# Altium schematic sheet POWER.SchDoc (part 2 of 3)
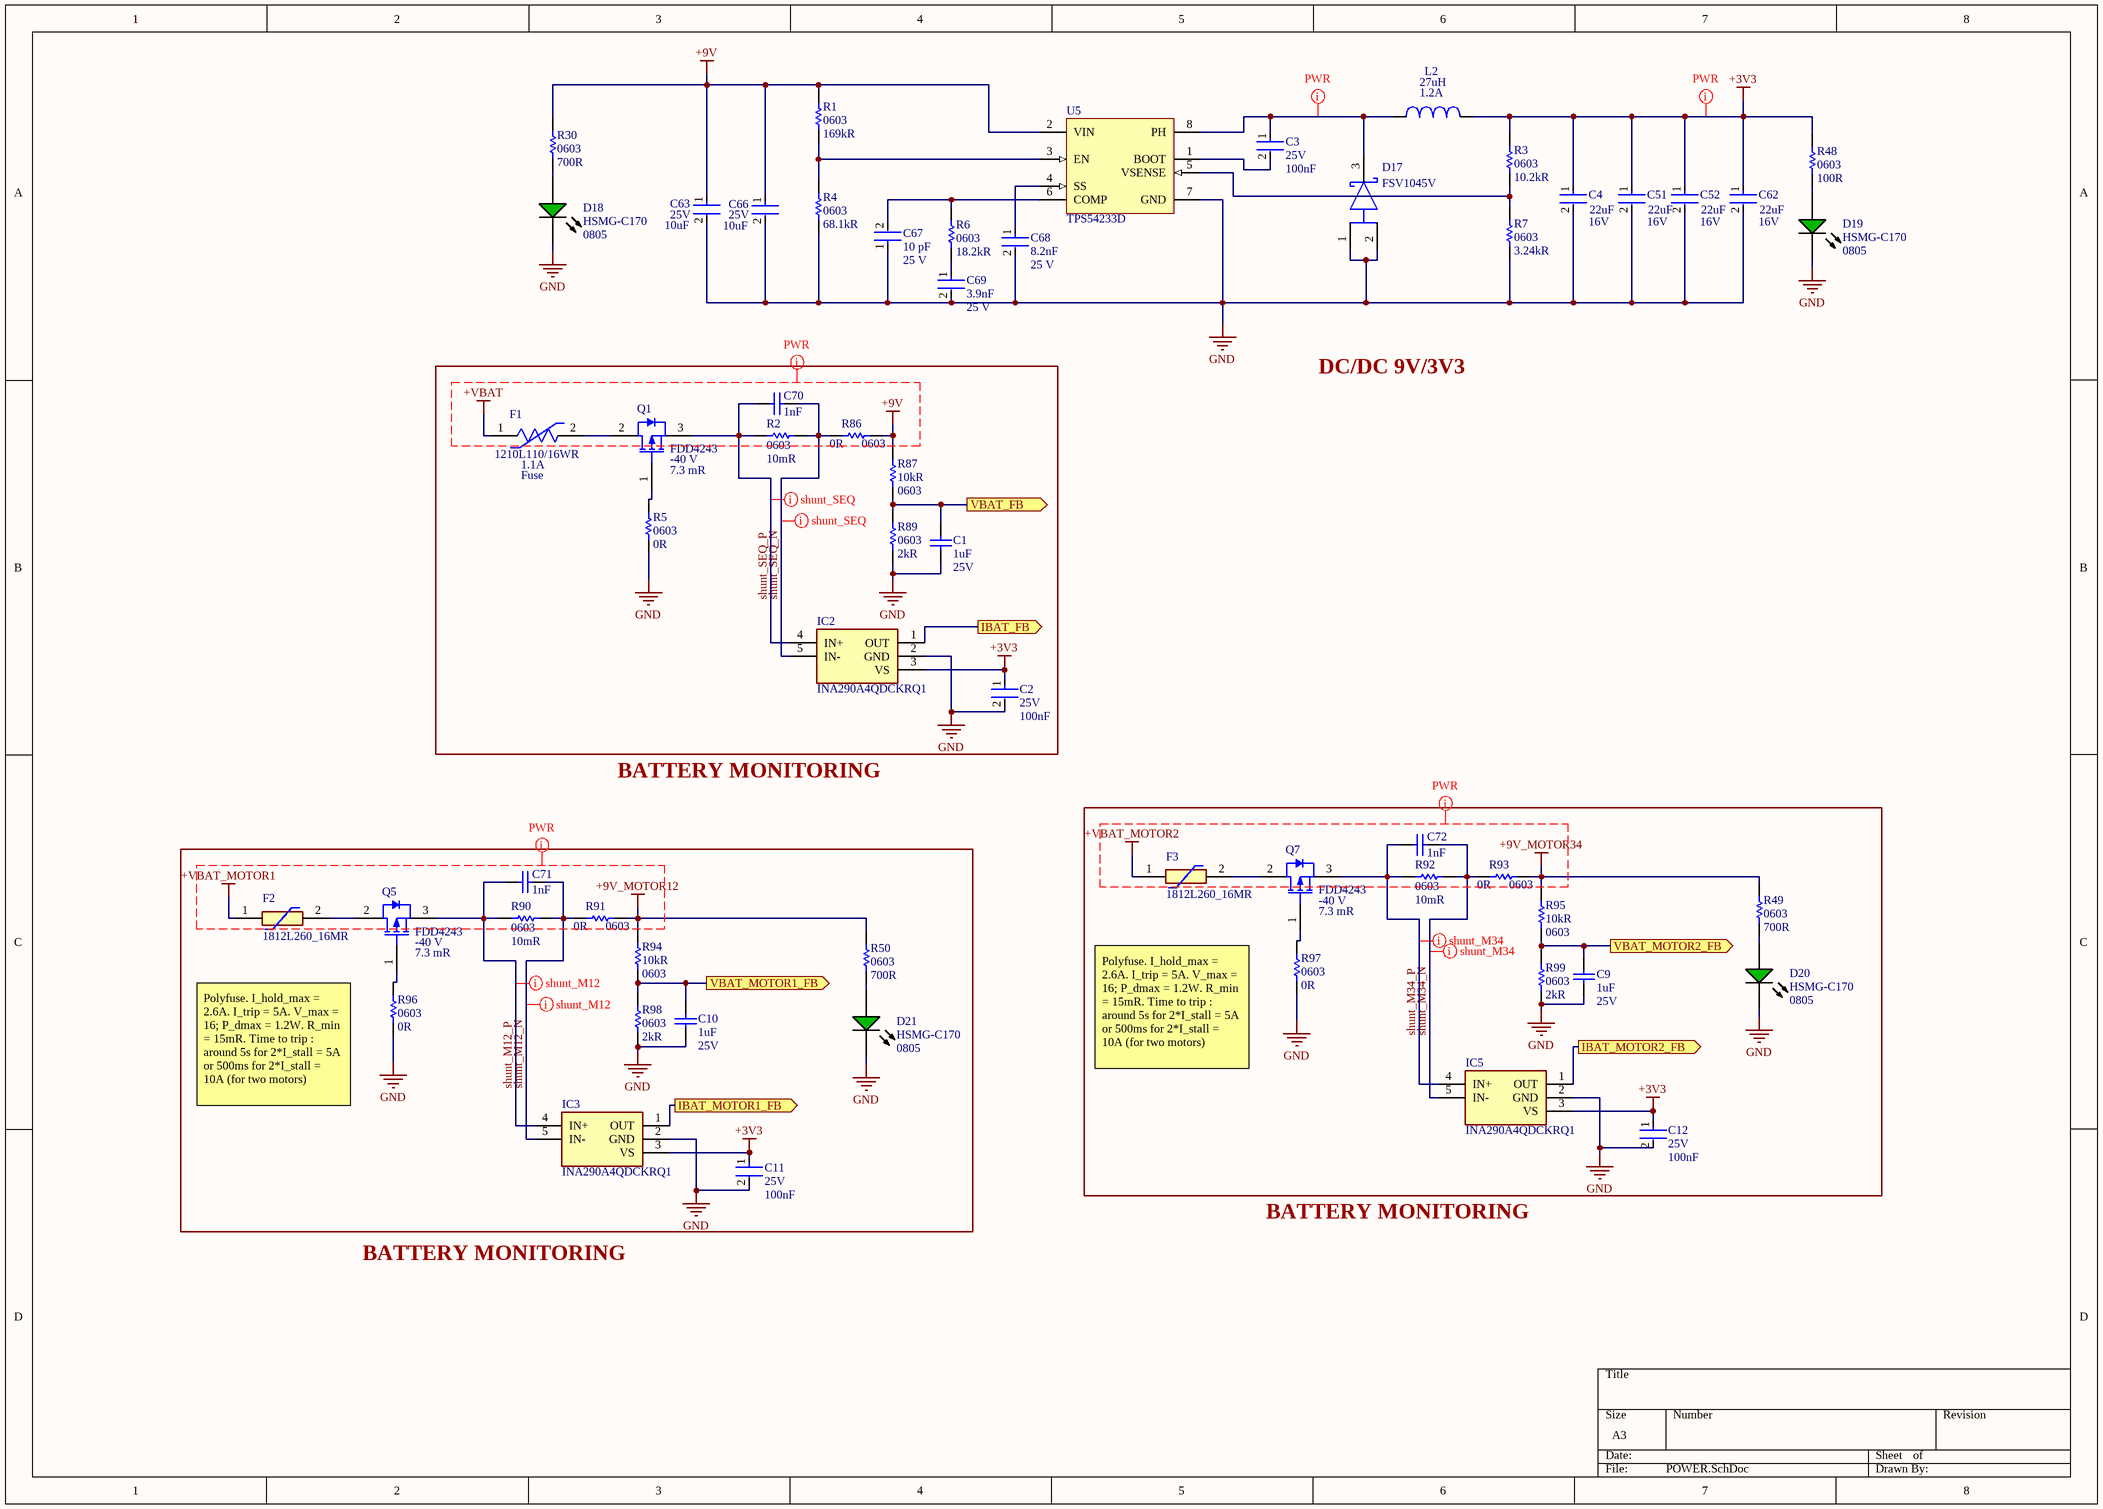
[diagram p1: POWER.SchDoc]
## Library data of the parts
C1 C9 C10 = CMP-2006-02216-2: Manufacturer: Kemet; Manufacturer Part Number: C0603C105K3PACTU; Dielectric Material: Ceramic; Tolerance: 10%; Dielectric: X5R; Part Number: C0603C105K3PAC7867; Supplier 1: Mouser; Supplier Part Number 1: 80-C0603C105K3P; RoHS: Yes; Category: Ceramic Capacitors; Stock 1: 10085; Pricing 1: 1=0,30000, 10=0,15600, 50=0,15600, 100=0,09300, 500=0,08200, 1000=0,07300, 4000=0,05700, 10000=0,05700 (USD); Mount: Surface Mount,PCB; Case/Package: 0603; Number of Pins: 2; Case Code (Imperial): 0603; Case Code (Metric): 1608; Contact Plating: Tin,Matte; Min Operating Temperature: -55°C; Max Operating Temperature: 85°C; Packaging: Tape and Reel; Termination: SMD/SMT; Voltage Rating: 25V; Package Quantity: 4000; Voltage: 25V; Series: C0603C; Construction: Flat; Length: 1.6mm; Width: 0.031inch; Height: 0.8mm; Depth: 0.8mm; Thickness: 0.034inch; Radiation Hardening: No; REACH SVHC: No SVHC; RoHS Compliant: Yes; Lead Free: Lead Free; ComponentLink1URL: https://datasheet.ciiva.com/5998/40889-5998745.pdf?src-supplier=Farnell; ComponentLink1Description: https://datasheet.ciiva.com/5998/40889-5998745.pdf?src-supplier=Farnell; ComponentLink2URL: https://datasheet.ciiva.com/28610/1918694-28610792.pdf?src-supplier=Element14; ComponentLink2Description: https://datasheet.ciiva.com/28610/1918694-28610792.pdf?src-supplier=Element14
C2 C3 C11 C12 = CMP-08246-002186-1: Cap Ceramic 100nF 25V X7R 10% Pad SMD 0603 +125°C Automotive T/R; Manufacturer: TDK; Composition: Ceramic; Dielectric: X7R; Ratings: AEC-Q200; Length: 1.6mm; REACH SVHC: No SVHC; Width: 0.031inch; Packaging: Tape and Reel; Case/Package: 0603; Height: 0.8mm; Termination: SMD/SMT; Max Operating Temperature: 125°C; Thickness: 0.035inch; Case Code (Metric): 1608; Lead Free: Lead Free; Mount: Surface Mount; Voltage Rating: 25V; Tolerance: 10%; Weight: 7.1E-05oz; Min Operating Temperature: -55°C; Package Quantity: 1; Depth: 0.8mm; Case Code (Imperial): 0603; Supplier 1: Mouser; Supplier Part Number 1: 810-CGA3E2X7R1E104K; Manufacturer Part Number: CGA3E2X7R1E104K080AA; RoHS: Yes; Category: Ceramic Capacitors; Stock 1: 488891; Pricing 1: 1=0,12000, 10=0,05600, 50=0,05600, 100=0,02500, 1000=0,01400, 10000=0,01000 (USD); Series: CGA; Resistor Type: Ceramic; RoHS Compliant: Yes; ComponentLink1URL: https://datasheet.ciiva.com/24220/cga3e2x7r1e104k080aa-265934-24220022.pdf?src-supplier=Mouser; ComponentLink1Description: https://datasheet.ciiva.com/24220/cga3e2x7r1e104k080aa-265934-24220022.pdf?src-supplier=Mouser; ComponentLink2URL: https://datasheet.ciiva.com/22725/1735392-22725638.pdf?src-supplier=Element14; ComponentLink2Description: https://datasheet.ciiva.com/22725/1735392-22725638.pdf?src-supplier=Element14; ComponentLink3URL: https://datasheet.ciiva.com/22725/1735392-22725639.pdf?src-supplier=Element14; ComponentLink3Description: https://datasheet.ciiva.com/22725/1735392-22725639.pdf?src-supplier=Element14; ComponentLink4URL: https://datasheet.ciiva.com/16427/mlccspec-automotive-general-midvoltage-en-16427320.pdf?src-supplier=Future+Electronics; ComponentLink4Description: https://datasheet.ciiva.com/16427/mlccspec-automotive-general-midvoltage-en-16427320.pdf?src-supplier=Future+Electronics; ComponentLink5URL: https://datasheet.ciiva.com/23803/1735392-23803082.pdf?src-supplier=Newark; ComponentLink5Description: https://datasheet.ciiva.com/23803/1735392-23803082.pdf?src-supplier=Newark
C4 C51 C52 C62 = CMP-2000-06037-2: CAP CER 22UF 16V X5R 0805; Manufacturer: TDK; Tolerance: 10%; Material: Ceramic; Temperature Coefficient: 15%; Octopart: https://octopart.com/c2012x5r1c226k125ac-tdk-25947713; ComponentLink2Description: Datasheet; Category: Cap; Temperature: -55°C to +85°C; Device Class L3: Ceramic Capacitors; ComponentLink2URL: https://product.tdk.com/info/en/catalog/datasheets/mlcc_commercial_general_en.pdf; Lead Free: Yes; Temperature Range High: +85°C; Temperature Range Low: -55°C; Package: C2012-125; RoHS: TRUE; Temperature Characteristic: X5R; Voltage Rating: 16V; Height: 1.45mm; Digikey Description: CAP CER 22UF 16V X5R 0805; Capacitance: 22uF; Manufacturer Part Number: C2012X5R1C226K125AC; Device Class L1: Passive Components; Device Class L2: Capacitors; Footprint Url: https://product.tdk.com/info/en/catalog/spec/mlccspec_commercial_general_midvoltage_en.pdf; Ipc Land Pattern Name: CAPC200125X125; Automotive: No
C63 C66 = CMP-08246-002675-1: Multilayer Ceramic Capacitors 10μF ±10% 25V X5R SMD 0805; Manufacturer: TDK; Packaging: Tape and Reel; Dielectric: X5R; Case/Package: 0805; Lead Free: Lead Free; Dielectric Material: Ceramic; Series: C; Termination: SMD/SMT; Voltage: 25V; Depth: 1.25mm; Max Operating Temperature: 85°C; Resistor Type: Ceramic; Weight: 0.000194oz; Case Code (Metric): 2012; Height: 1.25mm; Mount: Surface Mount; Voltage Rating: 25V; Length: 2mm; REACH SVHC: No SVHC; Min Operating Temperature: -55°C; Case Code (Imperial): 0805; Thickness: 0.057inch; Width: 0.049inch; Tolerance: 10%; Package Quantity: 1; Supplier 1: Mouser; Supplier Part Number 1: 810-C2012X5R1E106K; Manufacturer Part Number: C2012X5R1E106K125AB; RoHS: Yes; Category: Ceramic Capacitors; Stock 1: 75897; Pricing 1: 1=0,34000, 10=0,24100, 50=0,24100, 100=0,14400, 1000=0,09100, 10000=0,08800 (USD); ComponentLink1URL: https://datasheet.ciiva.com/22725/1913358-22725561.pdf?src-supplier=Element14; ComponentLink1Description: https://datasheet.ciiva.com/22725/1913358-22725561.pdf?src-supplier=Element14; ComponentLink2URL: https://datasheet.ciiva.com/16394/general-b11-16394044.pdf?src-supplier=Future+Electronics; ComponentLink2Description: https://datasheet.ciiva.com/16394/general-b11-16394044.pdf?src-supplier=Future+Electronics; ComponentLink3URL: https://datasheet.ciiva.com/24216/mlcc-commercial-general-en-24216237.pdf?src-supplier=Mouser; ComponentLink3Description: https://datasheet.ciiva.com/24216/mlcc-commercial-general-en-24216237.pdf?src-supplier=Mouser
C67 = CMP-03020-028619-1: CAP CER 10PF 25V NP0 0603; Manufacturer: KEMET; Automotive Grade: Grade 1; Tolerance: 0.05; Temperature Characteristic: C0G; Material: Ceramic; Temperature Coefficient: 30ppm/°C; Dissipation Factor: 0.1%; Value: 10 pF; Manufacturer Part Number: C0603C100J3GACTU; Height: 0.87mm; Temperature Range High: +125°C; Automotive: Yes; Category: Cap; Temperature Range Low: -55°C; Device Class L2: Capacitors; ComponentLink2Description: Datasheet; Digikey Description: CAP CER 10PF 25V NP0 0603; Lead Free: Yes; Temperature: -55°C to +125°C; Package: C0603C-CF; Mouser Description: Capacitor, Ceramic, 10Pf, 25Vdc, 5-% Tol, 5+% Tol, C0g-Tc Code, -30, 30Ppm-Tc Rohs Compliant: Yes; Device Class L3: Ceramic Capacitors; Octopart: https://octopart.com/c0603c100j3gactu-kemet-16430573; ComponentLink2URL: https://api.kemet.com/component-edge/download/datasheet/C0603C100J5GACAUTO.pdf; Device Class L1: Passive Components; RoHS: TRUE; Supplier 1: Mouser; Supplier Part Number 1: 80-C0603C100J3G; Stock 1: 3745; Pricing 1: 1=0,26000, 10=0,18000, 50=0,18000, 100=0,10300, 1000=0,06400, 10000=0,05500 (USD); Mount: Surface Mount; Case/Package: 0603; Case Code (Metric): 1608; Case Code (Imperial): 0603; Dielectric Material: Ceramic; Min Operating Temperature: -55°C; Max Operating Temperature: 125°C; Package Quantity: 4000; Packaging: Tape and Reel; Voltage Rating (DC): 25V; Dielectric: C0G; Termination: SMD/SMT; Series: C; Construction: Flat; Length: 1.6mm; Width: 0.031inch; Thickness: 0.034inch; Depth: 0.8mm; Lead Pitch: 0.7mm; Radiation Hardening: No; RoHS Compliant: Yes; ComponentLink1URL: https://datasheet.ciiva.com/5450/kem-c1003-c0g-smd-356956-5450264.pdf?src-supplier=Mouser; ComponentLink1Description: https://datasheet.ciiva.com/5450/kem-c1003-c0g-smd-356956-5450264.pdf?src-supplier=Mouser
C68 = CMP-2006-03852-2: CAP CER 8200PF 25V X7R 0603; Manufacturer: KEMET; Automotive Grade: Grade 1; Capacitance: 8,200 pF; Tolerance: 0.1; Material: Ceramic; Temperature Coefficient: 30ppm/°C; Dissipation Factor: 10%; Temperature Characteristic: X7R; Height: 0.87mm; Device Class L2: Capacitors; Device Class L1: Passive Components; Temperature Range High: +125°C; ComponentLink2URL: https://api.kemet.com/component-edge/download/datasheet/C0603C100J5GACAUTO.pdf; ComponentLink2Description: Datasheet; Mouser Description: Capacitor, Ceramic, 8.2Nf, 25Vdc, 10-% Tol, 10+% Tol, X7r-Tc Code, -15, 15%-Tc Rohs Compliant: Yes; Temperature: -55°C to +125°C; Lead Free: Yes; Device Class L3: Ceramic Capacitors; Temperature Range Low: -55°C; Package: C0603C-CF; Octopart: https://octopart.com/c0603c822k3ractu-kemet-9144236; Category: Cap; RoHS: TRUE; Digikey Description: CAP CER 8200PF 25V X7R 0603; Manufacturer Part Number: C0603C822K3RACTU; Automotive: Yes; Supplier 1: Mouser; Supplier Part Number 1: 80-C0603C822K3R; Stock 1: 7611; Pricing 1: 1=0,26000, 10=0,18000, 50=0,18000, 100=0,10200, 1000=0,06300, 10000=0,05500 (USD); Mount: Surface Mount; Case/Package: 0603; Case Code (Metric): 1608; Case Code (Imperial): 0603; Dielectric Material: Ceramic; Min Operating Temperature: -55°C; Max Operating Temperature: 125°C; Packaging: Tape and Reel; Termination: SMD/SMT; Voltage Rating (DC): 25V; Package Quantity: 4000; Series: C; Dielectric: X7R; Length: 1.6mm; Width: 0.031inch; Thickness: 0.034inch; Depth: 0.8mm; Lead Pitch: 0.7mm; RoHS Compliant: Yes; ComponentLink1URL: https://datasheet.ciiva.com/5437/kem-c1002-x7r-smd-357932-5437145.pdf?src-supplier=Mouser; ComponentLink1Description: https://datasheet.ciiva.com/5437/kem-c1002-x7r-smd-357932-5437145.pdf?src-supplier=Mouser
C69 = CMP-1035-02159-3: CAP CER 3900PF 25V X7R 0603; Manufacturer: KEMET; Automotive Grade: Grade 1; Value: 3,900 pF; Material: Ceramic; Tolerance: 0.1; Temperature Coefficient: 30ppm/°C; Temperature Range Low: -55°C; Automotive: Yes; Digikey Description: CAP CER 3900PF 25V X7R 0603; Device Class L1: Passive Components; Device Class L2: Capacitors; Octopart: https://octopart.com/c0603c392k3ractu-kemet-12624904; Mouser Description: Cap Ceramic 0.0039uF 25V X7R 10% SMD 0603 125°C Paper T/R; ComponentLink2URL: https://api.kemet.com/component-edge/download/datasheet/C0603C100J5GACAUTO.pdf; Lead Free: Yes; Manufacturer Part Number: C0603C392K3RACTU; RoHS: TRUE; Category: Cap; ComponentLink2Description: Datasheet; Height: 0.87mm; Device Class L3: Ceramic Capacitors; Package: C0603C-CF; Temperature Characteristic: X7R; Temperature: -55°C to +125°C; Temperature Range High: +125°C; Supplier 1: Mouser; Supplier Part Number 1: 80-C0603C392K3R; Stock 1: 897; Pricing 1: 1=0,26000, 10=0,18000, 50=0,18000, 100=0,10200, 1000=0,06300, 10000=0,05500 (USD); Mount: Surface Mount; Case/Package: 0603; Case Code (Imperial): 0603; Case Code (Metric): 1608; Dielectric Material: Ceramic; Weight: 7.1E-05oz; Min Operating Temperature: -55°C; Max Operating Temperature: 125°C; Packaging: Tape and Reel; Voltage Rating (DC): 25V; Termination: SMD/SMT; Dielectric: X7R; Series: C; Package Quantity: 4000; Length: 1.6mm; Width: 0.8mm; Thickness: 0.034inch; Depth: 0.8mm; RoHS Compliant: Yes; ComponentLink1URL: http://components.arrow.com/part/dataview/3445519S6614818N7429?src-supplier=Arrow+Electronics; ComponentLink1Description: http://components.arrow.com/part/dataview/3445519S6614818N7429?src-supplier=Arrow+Electronics; ComponentLink3URL: http://www.mouser.com/ds/2/212/KEM_C1002_X7R_SMD-1102033.pdf?src-supplier=Mouser; ComponentLink3Description: http://www.mouser.com/ds/2/212/KEM_C1002_X7R_SMD-1102033.pdf?src-supplier=Mouser; ComponentLink4URL: http://www.kemet.com/docfinder?Partnumber=C0603C392K3RACTU&src-supplier=Digi-Key; ComponentLink4Description: http://www.kemet.com/docfinder?Partnumber=C0603C392K3RACTU&src-supplier=Digi-Key
C70-C72 = CMP-2000-05332-1: Multi-layer Ceramic Capacitor, -55 to 125 degC, 2-Pin SMD (0603), RoHS, Tape and Reel; Manufacturer: Samsung Electro-Mechanics; Capacitance: 0.1µF; Rated Voltage: 50V; Dielectric: X7R; Tolerance (%): ±10%; Case Size/Dimension: 0603; Datasheet URL: https://datasheet.ciiva.com/29198/456651-da-01-en-vs-kondensator-0605-29198839.pdf; Manufacturer URL: http://www.samsungsem.com/global/index.jsp; Datasheet Version: Nov-10
D17 = CMP-07162-000007-1: DIODE SCHOTTKY 45V 10A TO277-3; Manufacturer: ON Semiconductor; Standoff Height: 0.01mm; Capacitance: 820pF; Max Surge Forward Current: 300A; Peak Reverse Current: 0.065mA; Value: 820pF; Max Junction Temp: +150°C; ComponentLink2URL: https://www.onsemi.com/pub/Collateral/FSV1045V-D.pdf; Mouser Description: Schottky Diodes & Rectifiers Schottky; RoHS: TRUE; Device Class L1: Discrete Semiconductors; Digikey Description: DIODE SCHOTTKY 45V 10A TO277-3; Category: Diode; Temperature Range Low: -55°C; Max Repetitive Reverse Voltage: 45V; Temperature Range High: +150°C; Height: 1.2mm; Footprint Url: https://www.onsemi.com/pub/Collateral/340BQ.PDF; Package: 340BQ; Device Class L3: Schottky Diodes; Temperature: -55°C to +150°C; Lead Free: Yes; ComponentLink2Description: Datasheet; Automotive: No; Reverse Voltage: 45V; Manufacturer Part Number: FSV1045V; Device Class L2: Diodes; Octopart: https://octopart.com/fsv1045v-on+semiconductor-84328650; Forward Current: 10A
D18-D21 = CMP-2000-05062-1: Chip LED, Green, 2.2 V, -40 to 85 degC, 2-Pin SMD, Pb-Free, Tape and Reel; Manufacturer: Avago; No. of Pins: 2; Peak Wavelength: 570nm; SVHC: NoSVHC(16-Jun-2014); Dominant Wavelength: 572nm; Forward Current If: 20mA; Viewing Angle: 170deg; Lens Shape: Rectangular; PIV Max: 5V; External Width: 1.25mm; LED Type: Standard; External Depth: 0.8mm; Opto Mounting Orientation: Top; Luminous Intensity: 15mcd; Luminous Intensity Min: 4mcd; Forward Voltage VF Max: 2.6V; External Length / Height: 2mm; Bulb Size: 1.25mmx1.4mm; Light Area Height: 1mm; Voltage Vf Typ: 2.2V; Color: Green,Yellow; Lens Color: White; Lens Style: Diffused,Colorless,Rectangular; Lens Transparency: Diffused; Power Dissipation: 52mW; Number of Elements: 1; Operating Temperature Max: 85degC; Datasheet Version: Oct-08; MSL: MSL2A-4weeks; Peak Forward Current: 20mA; Package Description: 2-Pin Surface Mount Device, Body 2 x 1.25 mm, Height 0.8 mm; Datasheet URL: https://datasheet.ciiva.com/29280/180495-da-01-en-chip-led-hsmg-c170-gelb-gruen-29280971.pdf; Storage Temperature Min: -40degC; LED Colour: Green; Wavelength Typ: 570nm; Mounting Type: SMD; Forward Current If Max: 20mA; Dominant Wavelength Typ: 572nm; LED Mounting: SMD; Operating Temperature Range: -30degCto+85degC; Operating Temperature Min: -30degC; Manufacturer URL: http://www.avagotech.com/; Packaging: CutTape; Luminous Intensity Typ: 15mcd; Package Reference: HSMX-C170; Storage Temperature Max: 85degC; Opto Case Style: SMD; Forward Voltage: 2.2V; Supplier 1: Mouser; Supplier Part Number 1: 630-HSMG-C170; Manufacturer Part Number: HSMG-C170; RoHS: Yes; Category: LEDs; Stock 1: 2037; Pricing 1: 1=0,39000, 10=0,25800, 50=0,25800, 100=0,12000, 1000=0,10000, 4000=0,08400, 8000=0,07600, 10000=0,07600, 24000=0,07100, 48000=0,06700 (USD); Mount: Surface Mount; Number of Pins: 2; Case Code (Metric): 2012; Case Code (Imperial): 0805; Min Operating Temperature: -30°C; Max Operating Temperature: 85°C; Wavelength: 572nm; Forward Current: 20mA; Test Current: 20mA; Package Quantity: 4000; Illumination Color: Green; Power Rating: 52mW; Number of LEDs: 1; Reverse Voltage: 5V; Series: -; Length: 2mm; Width: 1.25mm; Height: 0.8mm; Depth: 1.25mm; Radiation Hardening: No; REACH SVHC: No SVHC; Lead Free: Lead Free; RoHS Compliant: Yes
F1 = CMP-08606-000029-1: PTC RESET FUSE 16V 1.1A 1210; Manufacturer: Littelfuse Inc; Trip Time: 0.1s; Value: 0.06-0.21Ω; Trip Current: 2.2A; Current Rating: 100A; Ambient Temperature Range Low: -40°C; Voltage Rating: 16V; ComponentLink2URL: https://www.littelfuse.com/~/media/electronics/datasheets/resettable_ptcs/littelfuse_ptc_1210l_datasheet.pdf.pdf; Device Class L2: PTC Resettable Fuses; Automotive: No; Temperature: -40°C to +85°C; Mouser Description: Resettable Fuses - PPTC 16V 1.10A 1210 PTC; Temperature Range High: +85°C; Manufacturer Part Number: 1210L110/16WR; Temperature Range Low: -40°C; Device Class L1: Circuit Protection; Octopart: https://octopart.com/1210l110%2F16wr-littelfuse-28867107; Lead Free: Yes; Resistance: 0.06-0.21Ω; RoHS: TRUE; Digikey Description: PTC RESET FUSE 16V 1.1A 1210; Package: 0; Height: 1.25mm; Device Class L3: unset; ComponentLink2Description: Datasheet; Ambient Temperature Range High: +85°C
F2 F3 = 1812L260_16MR: Resettable Fuse; Manufacturer_Name: LITTELFUSE; Manufacturer_Part_Number: 1812L260/16MR; Datasheet Link: http://www.littelfuse.com/~/media/electronics/datasheets/resettable_ptcs/littelfuse_ptc_1812l_datasheet.pdf.pdf; Height: 1.25mm; Mouser Part Number: 576-1812L260/16MR; Mouser Price/Stock: https://www.mouser.co.uk/ProductDetail/Littelfuse/1812L260-16MR?qs=cIziFXvMxOVeszNO%252BSt%252B3Q%3D%3D; Arrow Part Number: 1812L260/16MR; Arrow Price/Stock: https://www.arrow.com/en/products/1812l26016mr/littelfuse
IC2 IC3 IC5 = INA290A4QDCKRQ1: Integrated Circuit; Manufacturer_Name: Texas Instruments; Datasheet Link: https://www.ti.com/lit/gpn/INA290-Q1; Height: 1.1mm; Manufacturer_Part_Number: INA290A4QDCKRQ1; Mouser Part Number: 595-INA290A4QDCKRQ1; Mouser Price/Stock: https://www.mouser.co.uk/ProductDetail/Texas-Instruments/INA290A4QDCKRQ1?qs=eP2BKZSCXI5u8rewO66qig%3D%3D; Arrow Part Number: INA290A4QDCKRQ1; Arrow Price/Stock: https://www.arrow.com/en/products/ina290a4qdckrq1/texas-instruments?region=nac
L2 = SRR6038-3R3Y: Inductor Power Shielded Wirewound 27uH 30% 100KHz 7.7Q-Factor Ferrite 1.2A 0.109Ohm DCR T/R; Manufacturer: Bourns; Material: Steel; DC Resistance (DCR): 109mR; Saturation Current: 1.3A; Self Resonant Frequency: 12.5MHz; Q Factor: 7.7; Supplier 1: Mouser; Supplier Part Number 1: 652-SRR6038-270Y; Manufacturer Part Number: SRR6038-270Y; RoHS: Yes; Category: Fixed Inductors; Stock 1: 846; Pricing 1: 1=0,97000, 10=0,67700, 50=0,67700, 100=0,60700, 1000=0,38200, 10000=0,38200 (USD); Mount: Surface Mount; Case/Package: Nonstandard; Core Material: Ferrite; Min Operating Temperature: -40°C; Max Operating Temperature: 125°C; Tolerance: 30%; Package Quantity: 1000; Current Rating: 1.2A; Shielding: Shielded; Packaging: Tape and Reel; Frequency: 12.5MHz; Resistor Type: Wirewound; Test Frequency: 100kHz; Termination: SMD/SMT; DC Current: 1.2A; Resistance: 109MR; Length: 6.8mm; Width: 6.8mm; Height: 3.8mm; Height - Seated (Max): 0.157inch; Depth: 7mm; Radiation Hardening: No; Military Standard: Not; ComponentLink1URL: https://datasheet.ciiva.com/1056/srr6038-1056609.pdf?src-supplier=Digi-Key; ComponentLink1Description: https://datasheet.ciiva.com/1056/srr6038-1056609.pdf?src-supplier=Digi-Key; ComponentLink2URL: https://datasheet.ciiva.com/1056/srr6038-1056610.pdf?src-supplier=Digi-Key; ComponentLink2Description: https://datasheet.ciiva.com/1056/srr6038-1056610.pdf?src-supplier=Digi-Key; ComponentLink3URL: https://datasheet.ciiva.com/8513/srr6038-8513401.pdf?src-supplier=Avnet; ComponentLink3Description: https://datasheet.ciiva.com/8513/srr6038-8513401.pdf?src-supplier=Avnet; ComponentLink4URL: https://datasheet.ciiva.com/48684/srr6038-48684847.pdf?src-supplier=Avnet; ComponentLink4Description: https://datasheet.ciiva.com/48684/srr6038-48684847.pdf?src-supplier=Avnet; ComponentLink5URL: https://datasheet.ciiva.com/41452/001056692-da-01-en-mag-abge-l-ind-srr6038-270y-27uh-1-2a-41452091.pdf?src-supplier=Conrad; ComponentLink5Description: https://datasheet.ciiva.com/41452/001056692-da-01-en-mag-abge-l-ind-srr6038-270y-27uh-1-2a-41452091.pdf?src-supplier=Conrad
Q1 Q5 Q7 = CMP-1138-00157-1: OptiMOS-P2 Power-Transistor, -40 V VDS, -85 A ID, PG-TO252-3-313, Reel, Green; PartNumber: IPD85P04P4-07; Manufacturer: Infineon; Ptot (max): 88 W; RthJC (max): 1.7 K/W; VGS(th) (max): -4 V; IDpuls (max): -340 A; VGS(th) (min): -2 V; ID (max): -85 A; QG: 69 nC; Green: TRUE; Mounting Technology: Surface Mount; Technology: OptiMOS-P2; ComponentLink1URL: http://www.infineon.com/; DatasheetVersion: Rev. 1.0; PackageReference: PG-TO252-3-313; ComponentLink2Description: Datasheet; ComponentLink2URL: http://www.infineon.com/dgdl/IPD85P04P4-07_DS_10.pdf?folderId=db3a304412b407950112b42b75b74520&fileId=db3a30432f69f146012f782666e92ddd&location=en.Products.Automotive_ICs.Automotive_MOSFETs.Single__P-Channel_40V_MOSFETs.DATASHEET.IPD85P04P4-07_DS_10.pdf; Halogen-free: TRUE; ComponentLink3Description: Package Specification; Packing: Reel; PackageVersion: Oct-10; PackageDescription: 3-Pin Plastic (Green) Transistor Single Outline Package, 6.5 x 6.12 mm Body, 2.28 mm Pitch; ComponentLink3URL: http://www.infineon.com/dgdl/PG-TO252-3-313-Package_Overview.pdf?folderId=db3a30432b57a660012b81890ade72d2&fileId=db3a30432b57a660012b8193af2872eb; ComponentLink1Description: Manufacturer URL
R1 = CMP-2000-00284-1: Manufacturer: Panasonic; Tolerance: 1%; Temperature Coefficient: 100ppm/°C; Max Power Dissipation: 100mW; Voltage Rating (DC): 50V; Voltage Rating: 75V; Part Number: ERJ-3EKF1693V; Supplier 1: Mouser; Supplier Part Number 1: 667-ERJ-3EKF1693V; Manufacturer Part Number: ERJ-3EKF1693V; RoHS: Yes; Category: Chip SMD Resistors; Stock 1: 1114; Pricing 1: 1=0,10000, 10=0,04200, 50=0,04200, 100=0,01700, 1000=0,00800, 10000=0,00400 (USD); Mount: Surface Mount; Case/Package: 0603; Case Code (Metric): 1608; Contact Plating: Tin; Min Operating Temperature: -55°C; Max Operating Temperature: 155°C; Packaging: Tape and Reel; Resistor Type: Thick Film; Number of Terminations: 2; Series: ERJ; Power Rating: 100mW; Package Quantity: 1; Termination: SMD/SMT; Features: Automotive AEC-Q200; Resistance Tolerance: 1%; Construction: Rectangular; Length: 1.6mm; Width: 0.031inch; Height: 0.022inch; Depth: 0.8mm; Radiation Hardening: No; RoHS Compliant: Yes; Lead Free: Lead Free; REACH SVHC: No SVHC; Military Standard: Not; ComponentLink1URL: https://datasheet.ciiva.com/46389/426256-46389786.pdf?src-supplier=Element14; ComponentLink1Description: https://datasheet.ciiva.com/46389/426256-46389786.pdf?src-supplier=Element14; ComponentLink2URL: https://datasheet.ciiva.com/46377/426256-46377704.pdf?src-supplier=Element14; ComponentLink2Description: https://datasheet.ciiva.com/46377/426256-46377704.pdf?src-supplier=Element14; ComponentLink3URL: https://datasheet.ciiva.com/28594/1678782-28594239.pdf?src-supplier=Element14; ComponentLink3Description: https://datasheet.ciiva.com/28594/1678782-28594239.pdf?src-supplier=Element14; ComponentLink4URL: https://datasheet.ciiva.com/28692/1678782-28692249.pdf?src-supplier=Element14; ComponentLink4Description: https://datasheet.ciiva.com/28692/1678782-28692249.pdf?src-supplier=Element14; ComponentLink5URL: https://datasheet.ciiva.com/24023/aoa0000ce2-24023871.pdf?src-supplier=Mouser; ComponentLink5Description: https://datasheet.ciiva.com/24023/aoa0000ce2-24023871.pdf?src-supplier=Mouser; ComponentLink6URL: https://datasheet.ciiva.com/9185/aoa0000ce2-9185127.pdf?src-supplier=Avnet; ComponentLink6Description: https://datasheet.ciiva.com/9185/aoa0000ce2-9185127.pdf?src-supplier=Avnet; ComponentLink7URL: https://datasheet.ciiva.com/30076/aoa0000ce2-30076535.pdf?src-supplier=Onlinecomponents.com; ComponentLink7Description: https://datasheet.ciiva.com/30076/aoa0000ce2-30076535.pdf?src-supplier=Onlinecomponents.com
R2 R90 R92 = CMP-2000-03799-1: Manufacturer: Vishay Dale; Tolerance: 1%; Temperature Coefficient: 75ppm/°C; Power Rating: 100mW; Part Number: WSL0603R0100FEA; Supplier 1: Mouser; Supplier Part Number 1: 71-WSL0603R0100FEA; Manufacturer Part Number: WSL0603R0100FEA; RoHS: No; Category: Chip SMD Resistors; Stock 1: 418; Pricing 1: 1=1,03000, 10=0,76500, 50=0,76500, 100=0,47100, 1000=0,39000, 5000=0,37200, 10000=0,37200 (USD); Case/Package: 0603; Number of Pins: 2; Case Code (Metric): 1608; Weight: 7.1E-05oz; Contact Plating: Tin,Matte; Min Operating Temperature: -65°C; Max Operating Temperature: 170°C; Packaging: Tape and Reel; Resistor Type: Metal Element,Metal Strip; Package Quantity: 1; Number of Terminations: 2; Termination: SMD/SMT; Max Power Dissipation: 100mW; Features: Moisture Resistant; Length: 0.06inch; Width: 0.03inch; Height: 0.33mm; Depth: 0.76mm; Radiation Hardening: No; Lead Free: Lead Free; REACH SVHC: Unknown; ComponentLink1URL: https://datasheet.ciiva.com/7791/1598296-7791987.pdf?src-supplier=Element14; ComponentLink1Description: https://datasheet.ciiva.com/7791/1598296-7791987.pdf?src-supplier=Element14; ComponentLink2URL: https://datasheet.ciiva.com/2482/wsl-2482914.pdf?src-supplier=Digi-Key; ComponentLink2Description: https://datasheet.ciiva.com/2482/wsl-2482914.pdf?src-supplier=Digi-Key; ComponentLink3URL: https://datasheet.ciiva.com/2482/wsl-2482915.pdf?src-supplier=Digi-Key; ComponentLink3Description: https://datasheet.ciiva.com/2482/wsl-2482915.pdf?src-supplier=Digi-Key; ComponentLink4URL: https://datasheet.ciiva.com/2482/wsl-2482916.pdf?src-supplier=Digi-Key; ComponentLink4Description: https://datasheet.ciiva.com/2482/wsl-2482916.pdf?src-supplier=Digi-Key; ComponentLink5URL: https://datasheet.ciiva.com/9049/wsl-9049413.pdf?src-supplier=Avnet; ComponentLink5Description: https://datasheet.ciiva.com/9049/wsl-9049413.pdf?src-supplier=Avnet; ComponentLink6URL: https://datasheet.ciiva.com/5469/wsl-101914-5469241.pdf?src-supplier=Mouser; ComponentLink6Description: https://datasheet.ciiva.com/5469/wsl-101914-5469241.pdf?src-supplier=Mouser; ComponentLink7URL: https://datasheet.ciiva.com/17189/wsl-17189978.pdf?src-supplier=Avnet+Europe; ComponentLink7Description: https://datasheet.ciiva.com/17189/wsl-17189978.pdf?src-supplier=Avnet+Europe; ComponentLink8URL: https://datasheet.ciiva.com/28621/1911169-28621724.pdf?src-supplier=Element14; ComponentLink8Description: https://datasheet.ciiva.com/28621/1911169-28621724.pdf?src-supplier=Element14; ComponentLink9URL: https://datasheet.ciiva.com/16510/wsl-16510141.pdf?src-supplier=Future+Electronics; ComponentLink9Description: https://datasheet.ciiva.com/16510/wsl-16510141.pdf?src-supplier=Future+Electronics; ComponentLink10URL: https://datasheet.ciiva.com/28621/1911169-28621725.pdf?src-supplier=Element14; ComponentLink10Description: https://datasheet.ciiva.com/28621/1911169-28621725.pdf?src-supplier=Element14; ComponentLink11URL: https://datasheet.ciiva.com/16755/70205438-16755071.pdf?src-supplier=Allied+Electronics; ComponentLink11Description: https://datasheet.ciiva.com/16755/70205438-16755071.pdf?src-supplier=Allied+Electronics
R3 = CMP-1012-00624-2: Manufacturer: Panasonic; Power Rating: 100mW; Tolerance: 1%; Voltage Rating: 75V; Temperature Coefficient: 100ppm/°C; Voltage Rating (DC): 50V; Part Number: ERJ-3EKF1022V; Supplier 1: Mouser; Supplier Part Number 1: 667-ERJ-3EKF1022V; Manufacturer Part Number: ERJ-3EKF1022V; RoHS: Yes; Category: Chip SMD Resistors; Stock 1: 583321; Pricing 1: 1=0,10000, 10=0,04200, 50=0,04200, 100=0,01700, 1000=0,00800, 2500=0,00700, 5000=0,00500, 10000=0,00400 (USD); Mount: Surface Mount; Case/Package: 0603; Case Code (Metric): 1608; Contact Plating: Tin; Min Operating Temperature: -55°C; Max Operating Temperature: 155°C; Packaging: Tape and Reel; Package Quantity: 1; Resistor Type: Thick Film; Series: ERJ; Number of Terminations: 2; Termination: SMD/SMT; Max Power Dissipation: 100mW; Features: Automotive AEC-Q200; Construction: Rectangular; Technology: THICK FILM; Resistance Tolerance: 1%; Length: 1.6mm; Width: 0.031inch; Height: 0.45mm; Depth: 0.8mm; Radiation Hardening: No; RoHS Compliant: Yes; Military Standard: Not; Lead Free: Lead Free; REACH SVHC: No SVHC; ComponentLink1URL: https://datasheet.ciiva.com/34303/1987492-34303567.pdf?src-supplier=Jameco; ComponentLink1Description: https://datasheet.ciiva.com/34303/1987492-34303567.pdf?src-supplier=Jameco; ComponentLink2URL: https://datasheet.ciiva.com/28531/1678782-28531526.pdf?src-supplier=Element14; ComponentLink2Description: https://datasheet.ciiva.com/28531/1678782-28531526.pdf?src-supplier=Element14; ComponentLink3URL: https://datasheet.ciiva.com/30119/aoa0000ce2-30119176.pdf?src-supplier=Onlinecomponents.com; ComponentLink3Description: https://datasheet.ciiva.com/30119/aoa0000ce2-30119176.pdf?src-supplier=Onlinecomponents.com; ComponentLink4URL: https://datasheet.ciiva.com/9194/aoa0000ce2-9194057.pdf?src-supplier=Avnet; ComponentLink4Description: https://datasheet.ciiva.com/9194/aoa0000ce2-9194057.pdf?src-supplier=Avnet; ComponentLink5URL: https://datasheet.ciiva.com/16777/70260748-16777515.pdf?src-supplier=Allied+Electronics; ComponentLink5Description: https://datasheet.ciiva.com/16777/70260748-16777515.pdf?src-supplier=Allied+Electronics; ComponentLink6URL: https://datasheet.ciiva.com/46377/426256-46377339.pdf?src-supplier=Element14; ComponentLink6Description: https://datasheet.ciiva.com/46377/426256-46377339.pdf?src-supplier=Element14; ComponentLink7URL: https://datasheet.ciiva.com/16511/aoa0000ce2-16511868.pdf?src-supplier=Avnet+Asia; ComponentLink7Description: https://datasheet.ciiva.com/16511/aoa0000ce2-16511868.pdf?src-supplier=Avnet+Asia; ComponentLink8URL: https://datasheet.ciiva.com/43460/426256-43460540.pdf?src-supplier=Farnell; ComponentLink8Description: https://datasheet.ciiva.com/43460/426256-43460540.pdf?src-supplier=Farnell; ComponentLink9URL: https://datasheet.ciiva.com/28658/1678782-28658333.pdf?src-supplier=Element14; ComponentLink9Description: https://datasheet.ciiva.com/28658/1678782-28658333.pdf?src-supplier=Element14; ComponentLink10URL: https://datasheet.ciiva.com/24069/aoa0000ce2-24069678.pdf?src-supplier=Mouser; ComponentLink10Description: https://datasheet.ciiva.com/24069/aoa0000ce2-24069678.pdf?src-supplier=Mouser
R4 = CMP-2000-00618-1: Manufacturer: Panasonic; Tolerance: 1%; Power Rating: 100mW; Temperature Coefficient: 100ppm/°C; Voltage Rating (DC): 50V; Voltage Rating: 75V; Part Number: ERJ-3EKF6812V; Supplier 1: Arrow Electronics; Supplier Part Number 1: ERJ-3EKF6812V; Manufacturer Part Number: ERJ-3EKF6812V; RoHS: Yes; Category: Chip SMD Resistors; Stock 1: 30000; Pricing 1: 5000=0,00560, 10000=0,00460 (USD); Mount: Surface Mount; Case/Package: 0603; Case Code (Metric): 1608; Contact Plating: Tin; Weight: 7.1E-05oz; Min Operating Temperature: -55°C; Max Operating Temperature: 155°C; Packaging: Tape and Reel; Resistor Type: Thick Film; Number of Terminations: 2; Max Power Dissipation: 100mW; Package Quantity: 1; Series: ERJ; Construction: Rectangular; Features: Automotive AEC-Q200; Termination: SMD/SMT; Resistance Tolerance: 1%; Technology: THICK FILM; Length: 1.6mm; Width: 0.8mm; Height: 0.45mm; Depth: 0.8mm; Radiation Hardening: No; Military Standard: Not; Lead Free: Lead Free; RoHS Compliant: Yes; REACH SVHC: No SVHC; ComponentLink1URL: https://datasheet.ciiva.com/34303/1988348-34303604.pdf?src-supplier=Jameco; ComponentLink1Description: https://datasheet.ciiva.com/34303/1988348-34303604.pdf?src-supplier=Jameco; ComponentLink2URL: https://datasheet.ciiva.com/28692/1678782-28692517.pdf?src-supplier=Element14; ComponentLink2Description: https://datasheet.ciiva.com/28692/1678782-28692517.pdf?src-supplier=Element14; ComponentLink3URL: https://datasheet.ciiva.com/9117/aoa0000ce2-9117129.pdf?src-supplier=Avnet; ComponentLink3Description: https://datasheet.ciiva.com/9117/aoa0000ce2-9117129.pdf?src-supplier=Avnet; ComponentLink4URL: https://datasheet.ciiva.com/16514/aoa0000ce2-16514154.pdf?src-supplier=Avnet+Asia; ComponentLink4Description: https://datasheet.ciiva.com/16514/aoa0000ce2-16514154.pdf?src-supplier=Avnet+Asia; ComponentLink5URL: https://datasheet.ciiva.com/16763/70260748-16763546.pdf?src-supplier=Allied+Electronics; ComponentLink5Description: https://datasheet.ciiva.com/16763/70260748-16763546.pdf?src-supplier=Allied+Electronics; ComponentLink6URL: https://datasheet.ciiva.com/46389/426256-46389259.pdf?src-supplier=Element14; ComponentLink6Description: https://datasheet.ciiva.com/46389/426256-46389259.pdf?src-supplier=Element14; ComponentLink7URL: https://datasheet.ciiva.com/28611/1678782-28611005.pdf?src-supplier=Element14; ComponentLink7Description: https://datasheet.ciiva.com/28611/1678782-28611005.pdf?src-supplier=Element14; ComponentLink8URL: https://datasheet.ciiva.com/30244/aoa0000ce2-30244301.pdf?src-supplier=Onlinecomponents.com; ComponentLink8Description: https://datasheet.ciiva.com/30244/aoa0000ce2-30244301.pdf?src-supplier=Onlinecomponents.com
R5 R86 R91 R93 R96 R97 = CMP-2100-03667-1: Chip Resistor, 0 Ohm, +/- 5%, 0.1 W, -55 to 155 degC, 0603 (1608 Metric), RoHS, Tape and Reel; Manufacturer: Yageo; Temperature Coefficient: 200ppm/degreesC; Voltage Rating: 50V; Power Rating: 100mW; Width: 0.8mm; Max Operating Temperature: 155degC; Tolerance: 5%; Package Reference: 0603; Height: 0.45mm; Depth: 0.8mm; Package Description: 2-Pin Surface Mount Device, Body 1.6 x 0.8 mm; Termination: SMD/SMT; Package Quantity: 5000; Case/Package: 0603; Radiation Hardening: No; Number of Pins: 2; Length: 1.6mm; Lead Free: LeadFree; Voltage Rating (DC): 50V; Military Standard: Not; Datasheet URL: http://www.yageo.com/NewPortal/yageodocoutput?fileName=/pdf/R-Chip/PYu-RC_Group_51_RoHS_L_5.pdf; Manufacturer URL: http://www.yageo.com/; Packaging: TapeandReel; Case Code (Metric): 1608; Min Operating Temperature: -55degC; Composition: ThickFilm; RoHSCompliant: true; Contact Plating: Tin; Datasheet Version: Rev. 5, 10/2016; REACH SVHC: NoSVHC
  R5 R96 R97: Supplier 1: Mouser; Supplier Part Number 1: 603-RC0603JR-070RL; Manufacturer Part Number: RC0603JR-070RL; RoHS: Yes; Category: Chip SMD Resistors; Stock 1: 968392; Pricing 1: 1=0,10000, 10=0,01000, 50=0,01000, 100=0,00500, 1000=0,00400, 5000=0,00200, 10000=0,00200 (USD); Size Code: 0603; Resistor Type: Thick Film; Features: Moisture Resistant; Series: RC; Max Power Dissipation: 100mW; Number of Terminations: 2; Construction: Rectangular; Technology: THICK FILM; Resistance Tolerance: 5%; RoHS Compliant: Yes; ComponentLink1URL: https://datasheet.ciiva.com/11808/pyu-r-int-6-11808700.pdf?src-supplier=RSComponents; ComponentLink1Description: https://datasheet.ciiva.com/11808/pyu-r-int-6-11808700.pdf?src-supplier=RSComponents; ComponentLink2URL: https://datasheet.ciiva.com/22747/443971-22747530.pdf?src-supplier=Element14; ComponentLink2Description: https://datasheet.ciiva.com/22747/443971-22747530.pdf?src-supplier=Element14; ComponentLink3URL: https://datasheet.ciiva.com/12555/rc0603-272842-12555254.pdf?src-supplier=Mouser; ComponentLink3Description: https://datasheet.ciiva.com/12555/rc0603-272842-12555254.pdf?src-supplier=Mouser; ComponentLink4URL: https://datasheet.ciiva.com/7746/1738695-7746421.pdf?src-supplier=Element14; ComponentLink4Description: https://datasheet.ciiva.com/7746/1738695-7746421.pdf?src-supplier=Element14; ComponentLink5URL: https://datasheet.ciiva.com/7746/1738695-7746422.pdf?src-supplier=Element14; ComponentLink5Description: https://datasheet.ciiva.com/7746/1738695-7746422.pdf?src-supplier=Element14; ComponentLink6URL: https://datasheet.ciiva.com/8883/pyu-rc0603-51-rohs-l-4-8883045.pdf?src-supplier=Avnet; ComponentLink6Description: https://datasheet.ciiva.com/8883/pyu-rc0603-51-rohs-l-4-8883045.pdf?src-supplier=Avnet; ComponentLink7URL: https://datasheet.ciiva.com/15189/getdatasheetpartid-329462-15189845.pdf?src-supplier=Verical; ComponentLink7Description: https://datasheet.ciiva.com/15189/getdatasheetpartid-329462-15189845.pdf?src-supplier=Verical
R6 = CMP-2000-00300-1: Manufacturer: Panasonic; Manufacturer Part Number: ERJ3EKF1822V; Tolerance: 1%; Temperature Coefficient: 100ppm/°C; Max Power Dissipation: 100mW; Voltage Rating (DC): 50V; Voltage Rating: 75V; Part Number: ERJ-3EKF1822V; Supplier 1: Mouser; Supplier Part Number 1: 667-ERJ-3EKF1822V; RoHS: Yes; Category: Chip SMD Resistors; Stock 1: 71432; Pricing 1: 1=0,10000, 10=0,04200, 50=0,04200, 100=0,01700, 1000=0,00800, 2500=0,00700, 5000=0,00500, 10000=0,00400 (USD); Mount: Surface Mount; Case/Package: 0603; Case Code (Metric): 1608; Contact Plating: Tin; Size Code: 0603; Min Operating Temperature: -55°C; Max Operating Temperature: 155°C; Packaging: Tape and Reel; Resistor Type: Thick Film; Number of Terminations: 2; Power Rating: 100mW; Package Quantity: 5000; Series: ERJ; Features: Automotive AEC-Q200; Termination: SMD/SMT; Construction: Rectangular; Resistance Tolerance: 1%; Length: 1.6mm; Width: 0.031inch; Height: 0.022inch; Depth: 0.8mm; Radiation Hardening: No; Lead Free: Lead Free; RoHS Compliant: Yes; Military Standard: Not; REACH SVHC: Unknown; ComponentLink1URL: https://datasheet.ciiva.com/46389/426256-46389405.pdf?src-supplier=Element14; ComponentLink1Description: https://datasheet.ciiva.com/46389/426256-46389405.pdf?src-supplier=Element14; ComponentLink2URL: https://datasheet.ciiva.com/24069/aoa0000ce2-24069017.pdf?src-supplier=Mouser; ComponentLink2Description: https://datasheet.ciiva.com/24069/aoa0000ce2-24069017.pdf?src-supplier=Mouser; ComponentLink3URL: https://datasheet.ciiva.com/16781/70260748-16781560.pdf?src-supplier=Allied+Electronics; ComponentLink3Description: https://datasheet.ciiva.com/16781/70260748-16781560.pdf?src-supplier=Allied+Electronics; ComponentLink4URL: https://datasheet.ciiva.com/16785/70260748-16785958.pdf?src-supplier=Allied+Electronics; ComponentLink4Description: https://datasheet.ciiva.com/16785/70260748-16785958.pdf?src-supplier=Allied+Electronics; ComponentLink5URL: https://datasheet.ciiva.com/9192/aoa0000ce2-9192376.pdf?src-supplier=Avnet; ComponentLink5Description: https://datasheet.ciiva.com/9192/aoa0000ce2-9192376.pdf?src-supplier=Avnet; ComponentLink6URL: https://datasheet.ciiva.com/16440/aoa0000ce1-16440201.pdf?src-supplier=Future+Electronics; ComponentLink6Description: https://datasheet.ciiva.com/16440/aoa0000ce1-16440201.pdf?src-supplier=Future+Electronics; ComponentLink7URL: https://datasheet.ciiva.com/48531/aoa0000ce2-48531054.pdf?src-supplier=Avnet; ComponentLink7Description: https://datasheet.ciiva.com/48531/aoa0000ce2-48531054.pdf?src-supplier=Avnet; ComponentLink8URL: https://datasheet.ciiva.com/30212/aoa0000ce2-30212159.pdf?src-supplier=Onlinecomponents.com; ComponentLink8Description: https://datasheet.ciiva.com/30212/aoa0000ce2-30212159.pdf?src-supplier=Onlinecomponents.com
R7 = CMP-2000-00432-1: Manufacturer: Panasonic; Power Rating: 100mW; Tolerance: 1%; Voltage Rating: 75V; Temperature Coefficient: 100ppm/°C; Voltage Rating (DC): 50V; Part Number: ERJ-3EKF3241V; Supplier 1: Mouser; Supplier Part Number 1: 667-ERJ-3EKF3241V; Manufacturer Part Number: ERJ-3EKF3241V; RoHS: Yes; Category: Chip SMD Resistors; Stock 1: 45418; Pricing 1: 1=0,10000, 10=0,04200, 50=0,04200, 100=0,01700, 1000=0,00800, 2500=0,00700, 5000=0,00500, 10000=0,00400 (USD); Mount: Surface Mount; Case/Package: 0603; Case Code (Metric): 1608; Contact Plating: Tin; Min Operating Temperature: -55°C; Max Operating Temperature: 155°C; Packaging: Tape and Reel; Resistor Type: Thick Film; Number of Terminations: 2; Termination: SMD/SMT; Max Power Dissipation: 100mW; Package Quantity: 1; Features: Automotive AEC-Q200; Series: ERJ; Construction: Rectangular; Resistance Tolerance: 1%; Length: 1.6mm; Width: 0.031inch; Height: 0.022inch; Depth: 0.8mm; Radiation Hardening: No; RoHS Compliant: Yes; Military Standard: Not; Lead Free: Lead Free; REACH SVHC: No SVHC; ComponentLink1URL: https://datasheet.ciiva.com/46389/426256-46389034.pdf?src-supplier=Element14; ComponentLink1Description: https://datasheet.ciiva.com/46389/426256-46389034.pdf?src-supplier=Element14; ComponentLink2URL: https://datasheet.ciiva.com/5974/426256-5974521.pdf?src-supplier=Farnell; ComponentLink2Description: https://datasheet.ciiva.com/5974/426256-5974521.pdf?src-supplier=Farnell; ComponentLink3URL: https://datasheet.ciiva.com/28692/1678782-28692509.pdf?src-supplier=Element14; ComponentLink3Description: https://datasheet.ciiva.com/28692/1678782-28692509.pdf?src-supplier=Element14; ComponentLink4URL: https://datasheet.ciiva.com/24068/aoa0000ce2-24068846.pdf?src-supplier=Mouser; ComponentLink4Description: https://datasheet.ciiva.com/24068/aoa0000ce2-24068846.pdf?src-supplier=Mouser; ComponentLink5URL: https://datasheet.ciiva.com/16769/70260748-16769274.pdf?src-supplier=Allied+Electronics; ComponentLink5Description: https://datasheet.ciiva.com/16769/70260748-16769274.pdf?src-supplier=Allied+Electronics
R30 R48-R50 = CMP-2000-03637-1: Manufacturer: Vishay Dale; Tolerance: 1%; Power Rating: 100mW; Temperature Coefficient: 100ppm/°C; Voltage Rating: 75V; Part Number: CRCW060390R9FKEA; Supplier 1: Mouser; Supplier Part Number 1: 71-CRCW0603-90.9-E3; Manufacturer Part Number: CRCW060390R9FKEA; RoHS: Yes; Category: Chip SMD Resistors; Stock 1: 1004; Pricing 1: 1=0,11000, 10=0,04200, 50=0,04200, 100=0,01700, 1000=0,00900, 10000=0,00500 (USD); Case/Package: 0603; Case Code (Metric): 1608; Contact Plating: Tin; Weight: 7.1E-05oz; Min Operating Temperature: -55°C; Max Operating Temperature: 155°C; Packaging: Tape and Reel; Resistor Type: Thick Film; Number of Terminations: 2; Series: CRCW; Max Power Dissipation: 100mW; Resistance Tolerance: 1%; Package Quantity: 10; Termination: SMD/SMT; Technology: THICK FILM; Features: Automotive AEC-Q200; Construction: Rectangular; Working Voltage: 75V; Length: 1.55mm; Width: 0.85mm; Height: 0.45mm; Depth: 0.85mm; Radiation Hardening: No; RoHS Compliant: Yes; REACH SVHC: Unknown; Military Standard: Not; ComponentLink1URL: https://datasheet.ciiva.com/2494/dcrcwe3-2494729.pdf?src-supplier=Digi-Key; ComponentLink1Description: https://datasheet.ciiva.com/2494/dcrcwe3-2494729.pdf?src-supplier=Digi-Key; ComponentLink2URL: https://datasheet.ciiva.com/2494/dcrcwe3-2494730.pdf?src-supplier=Digi-Key; ComponentLink2Description: https://datasheet.ciiva.com/2494/dcrcwe3-2494730.pdf?src-supplier=Digi-Key; ComponentLink3URL: https://datasheet.ciiva.com/16758/70201119-16758186.pdf?src-supplier=Allied+Electronics; ComponentLink3Description: https://datasheet.ciiva.com/16758/70201119-16758186.pdf?src-supplier=Allied+Electronics; ComponentLink4URL: https://datasheet.ciiva.com/2494/dcrcwe3-2494731.pdf?src-supplier=Digi-Key; ComponentLink4Description: https://datasheet.ciiva.com/2494/dcrcwe3-2494731.pdf?src-supplier=Digi-Key; ComponentLink5URL: https://datasheet.ciiva.com/22705/1697337-22705563.pdf?src-supplier=Element14; ComponentLink5Description: https://datasheet.ciiva.com/22705/1697337-22705563.pdf?src-supplier=Element14; ComponentLink6URL: https://datasheet.ciiva.com/22683/1912744-22683196.pdf?src-supplier=Element14; ComponentLink6Description: https://datasheet.ciiva.com/22683/1912744-22683196.pdf?src-supplier=Element14; ComponentLink7URL: https://datasheet.ciiva.com/16199/dcrcwe3-16199774.pdf?src-supplier=Future+Electronics; ComponentLink7Description: https://datasheet.ciiva.com/16199/dcrcwe3-16199774.pdf?src-supplier=Future+Electronics; ComponentLink8URL: https://datasheet.ciiva.com/3257/dcrcwe3-3257967.pdf?src-supplier=Avnet; ComponentLink8Description: https://datasheet.ciiva.com/3257/dcrcwe3-3257967.pdf?src-supplier=Avnet
R87 R94 R95 = CMP-1012-00623-3: Chip Resistor, 10 KOhm, +/- 1%, 0.1 W, -55 to 155 degC, 0603 (1608 Metric), RoHS, Tape and Reel; Manufacturer: Panasonic; Manufacturer Part Number: ERJ-3EKF1002V; Voltage Rating: 75V; Power Rating: 100mW; Temperature Coefficient: 100ppm\/degreesC; Case\/Package: 0603; Number of Pins: 2; Package Reference: 603; Depth: 0.8mm; Mount: SurfaceMount; Package Description: 2-Pin Surface Mount Device, Body 1.6 x 0.85 mm; Datasheet Version: 02/2017; Length: 1.6mm; Lead Free: LeadFree; Height: 0.45mm; Number of Terminations: 2; Max Power Dissipation: 100mW; Min Operating Temperature: -55degC; Datasheet URL: https://industrial.panasonic.com/cdbs/www-data/pdf/RDA0000/AOA0000C304.pdf; Termination: SMD/SMT; Case Code (Metric): 1608; Tolerance: 1%; Max Operating Temperature: 155degC; RoHSCompliant: true; Voltage Rating (DC): 75V; Radiation Hardening: No; Packaging: TapeandReel; Composition: ThickFilm; Mounting Technology: SurfaceMount; Manufacturer URL: http://www.panasonic.com/; Width: 0.031inch; REACH SVHC: NoSVHC; Contact Plating: Tin; Military Standard: Not; Package Quantity: 1; Supplier 1: Mouser; Supplier Part Number 1: 667-ERJ-3EKF1002V; RoHS: Yes; Category: Chip SMD Resistors; Stock 1: 20455; Pricing 1: 1=0,10000, 10=0,04000, 50=0,04000, 100=0,01700, 1000=0,00700, 5000=0,00500, 10000=0,00500 (USD); Case/Package: 0603; Size Code: 0603; Resistor Type: Thick Film; Series: ERJ; Resistance Tolerance: 1%; Construction: Rectangular; Features: Automotive AEC-Q200; Technology: THICK FILM; RoHS Compliant: Yes; ComponentLink1URL: https://datasheet.ciiva.com/16511/aoa0000ce2-16511861.pdf?src-supplier=Avnet+Asia; ComponentLink1Description: https://datasheet.ciiva.com/16511/aoa0000ce2-16511861.pdf?src-supplier=Avnet+Asia; ComponentLink2URL: https://datasheet.ciiva.com/46372/1678782-46372725.pdf?src-supplier=Element14; ComponentLink2Description: https://datasheet.ciiva.com/46372/1678782-46372725.pdf?src-supplier=Element14; ComponentLink3URL: https://datasheet.ciiva.com/28514/426256-28514198.pdf?src-supplier=Element14; ComponentLink3Description: https://datasheet.ciiva.com/28514/426256-28514198.pdf?src-supplier=Element14; ComponentLink4URL: https://datasheet.ciiva.com/9194/aoa0000ce2-9194199.pdf?src-supplier=Avnet; ComponentLink4Description: https://datasheet.ciiva.com/9194/aoa0000ce2-9194199.pdf?src-supplier=Avnet; ComponentLink5URL: https://datasheet.ciiva.com/7830/aoa0000ce2-7830729.pdf?src-supplier=Element14; ComponentLink5Description: https://datasheet.ciiva.com/7830/aoa0000ce2-7830729.pdf?src-supplier=Element14; ComponentLink6URL: https://datasheet.ciiva.com/17212/aoa0000ce2-17212105.pdf?src-supplier=Avnet+Europe; ComponentLink6Description: https://datasheet.ciiva.com/17212/aoa0000ce2-17212105.pdf?src-supplier=Avnet+Europe; ComponentLink7URL: https://datasheet.ciiva.com/30208/aoa0000ce2-30208985.pdf?src-supplier=Onlinecomponents.com; ComponentLink7Description: https://datasheet.ciiva.com/30208/aoa0000ce2-30208985.pdf?src-supplier=Onlinecomponents.com; ComponentLink8URL: https://datasheet.ciiva.com/48530/aoa0000ce2-48530988.pdf?src-supplier=Avnet; ComponentLink8Description: https://datasheet.ciiva.com/48530/aoa0000ce2-48530988.pdf?src-supplier=Avnet; ComponentLink9URL: https://datasheet.ciiva.com/24070/aoa0000ce2-24070318.pdf?src-supplier=Mouser; ComponentLink9Description: https://datasheet.ciiva.com/24070/aoa0000ce2-24070318.pdf?src-supplier=Mouser; ComponentLink10URL: https://datasheet.ciiva.com/16759/70260748-16759807.pdf?src-supplier=Allied+Electronics; ComponentLink10Description: https://datasheet.ciiva.com/16759/70260748-16759807.pdf?src-supplier=Allied+Electronics
R89 R98 R99 = CMP-2000-00317-1: Manufacturer: Panasonic; Power Rating: 100mW; Tolerance: 1%; Voltage Rating: 75V; Temperature Coefficient: 100ppm/°C; Voltage Rating (DC): 50V; Part Number: ERJ-3EKF2001V; Supplier 1: Mouser; Supplier Part Number 1: 667-ERJ-3EKF2001V; Manufacturer Part Number: ERJ-3EKF2001V; RoHS: Yes; Category: Chip SMD Resistors; Stock 1: 44455; Pricing 1: 1=0,10000, 10=0,03200, 50=0,03200, 100=0,01500, 1000=0,00700, 10000=0,00400 (USD); Mount: Surface Mount; Case/Package: 0603; Case Code (Metric): 1608; Contact Plating: Tin; Size Code: 0603; Min Operating Temperature: -55°C; Max Operating Temperature: 155°C; Packaging: Tape and Reel; Package Quantity: 1; Resistor Type: Thick Film; Number of Terminations: 2; Termination: SMD/SMT; Max Power Dissipation: 100mW; Series: ERJ; Resistance Tolerance: 1%; Construction: Rectangular; Features: Automotive AEC-Q200; Length: 1.6mm; Width: 0.031inch; Height: 0.022inch; Depth: 0.8mm; Radiation Hardening: No; REACH SVHC: No SVHC; Military Standard: Not; Lead Free: Lead Free; RoHS Compliant: Yes; ComponentLink1URL: https://datasheet.ciiva.com/43460/1678782-43460485.pdf?src-supplier=Farnell; ComponentLink1Description: https://datasheet.ciiva.com/43460/1678782-43460485.pdf?src-supplier=Farnell; ComponentLink2URL: https://datasheet.ciiva.com/6082/1678782-6082059.pdf?src-supplier=Farnell; ComponentLink2Description: https://datasheet.ciiva.com/6082/1678782-6082059.pdf?src-supplier=Farnell; ComponentLink3URL: https://datasheet.ciiva.com/46377/1678782-46377366.pdf?src-supplier=Element14; ComponentLink3Description: https://datasheet.ciiva.com/46377/1678782-46377366.pdf?src-supplier=Element14; ComponentLink4URL: https://datasheet.ciiva.com/28673/1678782-28673990.pdf?src-supplier=Element14; ComponentLink4Description: https://datasheet.ciiva.com/28673/1678782-28673990.pdf?src-supplier=Element14; ComponentLink5URL: https://datasheet.ciiva.com/24027/aoa0000ce2-24027453.pdf?src-supplier=Mouser; ComponentLink5Description: https://datasheet.ciiva.com/24027/aoa0000ce2-24027453.pdf?src-supplier=Mouser; ComponentLink6URL: https://datasheet.ciiva.com/16771/70260748-16771369.pdf?src-supplier=Allied+Electronics; ComponentLink6Description: https://datasheet.ciiva.com/16771/70260748-16771369.pdf?src-supplier=Allied+Electronics; ComponentLink7URL: https://datasheet.ciiva.com/16200/aoa0000ce2-16200501.pdf?src-supplier=Future+Electronics; ComponentLink7Description: https://datasheet.ciiva.com/16200/aoa0000ce2-16200501.pdf?src-supplier=Future+Electronics; ComponentLink8URL: https://datasheet.ciiva.com/30064/aoa0000ce2-30064920.pdf?src-supplier=Onlinecomponents.com; ComponentLink8Description: https://datasheet.ciiva.com/30064/aoa0000ce2-30064920.pdf?src-supplier=Onlinecomponents.com; ComponentLink9URL: https://datasheet.ciiva.com/17214/aoa0000ce2-17214393.pdf?src-supplier=Avnet+Europe; ComponentLink9Description: https://datasheet.ciiva.com/17214/aoa0000ce2-17214393.pdf?src-supplier=Avnet+Europe